# EAGLE design FeatherAB1805-Li (EAGLE 9.6.2)
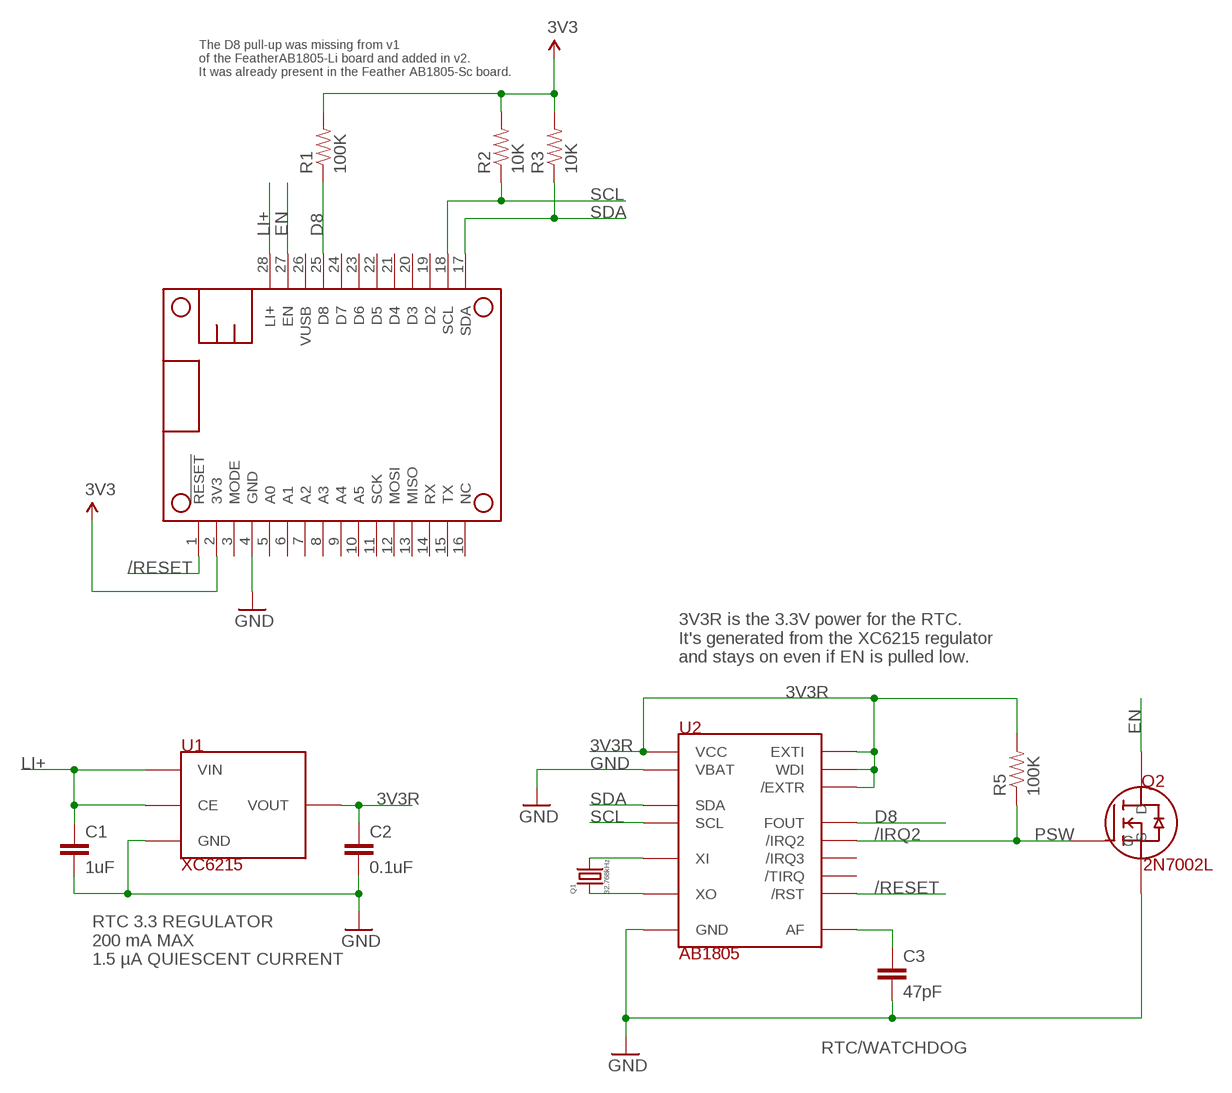
[diagram p0: schematic, sheet 1]

## Parts
C1  1uF  CAP-1UF-0603.DEV  [0603-CAP]
C2  0.1uF  CAP-0.1UF-0603  [0603-CAP]
C3  47pF  CAP-47PF-0603  [0603-CAP]
MS1  FEATHERWING_NODIM  [FEATHERWING_NODIM]
Q1  32.768kHz  ABS07-120-32.768KHZ  [ABS07-120-CRYSTAL]
Q2  2N7002L  [2N7002L]
R1  100K  RES-100K-0603  [0603-RES]
R2  10K  RES-10K-06030603  [0603-RES]
R3  10K  RES-10K-06030603  [0603-RES]
R5  100K  RES-100K-0603  [0603-RES]
U1  XC6215  [SOT-25-TOREX]
U2  AB1805  [16-VFQFN-ABRACON]

## Nets
3V3: MS1.2(3V3) R1.2 R2.2 R3.2
3V3R: C2.1 R5.2 U1.5(VOUT) U2.2(WDI) U2.3(/EXTR) U2.10(EXTI) U2.13(VCC)
/IRQ2: Q2.1(G) R5.1 U2.4(/IRQ2)
/RESET: MS1.1(!RESET) U2.1(/RST)
AF: C3.1 U2.14(AF)
D8: MS1.25(D8) R1.1 U2.11(FOUT)
EN: MS1.27(EN) Q2.3(D)
GND: C1.2 C2.2 C3.2 MS1.4(GND) Q2.2(S) U1.2(GND) U2.5(VBAT) U2.9(GND) U2.EP(GND)
LI+: C1.1 MS1.28(LI+) U1.1(VIN) U1.3(CE)
SCL: MS1.18(SCL) R2.1 U2.7(SCL)
SDA: MS1.17(SDA) R3.1 U2.6(SDA)
XI: Q1.2 U2.16(XI)
XO: Q1.1 U2.15(XO)
Unconnected: MS1.3(MODE) MS1.5(A0) MS1.6(A1) MS1.7(A2) MS1.8(A3) MS1.9(A4) MS1.10(A5) MS1.11(SCK) MS1.12(MOSI) MS1.13(MISO) MS1.14(RX) MS1.15(TX) MS1.16(NC) MS1.19(D2) MS1.20(D3) MS1.21(D4) MS1.22(D5) MS1.23(D6) MS1.24(D7) MS1.26(VUSB) U2.8(/IRQ3) U2.12(/TIRQ)

## Notes on the sheet
- The D8 pull-up was missing from v1
  of the FeatherAB1805-Li board and added in v2.
  It was already present in the Feather AB1805-Sc board.
- 3V3R is the 3.3V power for the RTC.
  It's generated from the XC6215 regulator
  and stays on even if EN is pulled low.
- PSW
- RTC 3.3 REGULATOR
  200 mA MAX
  1.5 µA QUIESCENT CURRENT
- RTC/WATCHDOG

## Library data of the parts
C1 = rickk2:CAP-1UF-0603.DEV: CAP CER 1UF 25V X7R 0603 $ 0.10 Samsung CL10B105KA8NNNC https://www.digikey.com/product-detail/en/samsung-electro-mechanics-america-inc/CL10B105KA8NNNC/1276-1184-1-ND/3889270 1µF ±10% 25V Ceramic Capacitor X7R 0603 (1608 Metric)
C2 = rickk2:CAP-0.1UF-0603: CAP CER 0.1UF 16V X7R 0603 https://www.digikey.com/product-detail/en/murata-electronics-north-america/GRM188R71C104KA01D/490-1532-1-ND/587771
C3 = rickk2:CAP-47PF-0603: CAP CER 47PF 100V C0G/NP0 0603 Murata Electronics GCM1885C2A470FA16D $0.22 47pF ±1% 100V Ceramic Capacitor C0G, NP0 0603 (1608 Metric) https://www.digikey.com/product-detail/en/murata-electronics/GCM1885C2A470FA16D/490-16408-1-ND/7363390 - Not ordered yet!
MS1 = Particle-Mesh:FEATHERWING
Q1 = rickk2:ABS07-120-32.768KHZ: CRYSTAL 32.7680KHZ 6PF SMD Abracon LLC ABS07-120-32.768KHZ-T $0.77 32.768kHz ±20ppm Crystal 6pF 55 kOhms 2-SMD, No Lead https://www.digikey.com/product-detail/en/abracon-llc/ABS07-120-32-768KHZ-T/535-11937-1-ND/3724046 - Not ordered yet
Q2 = rickk2:2N7002L: MOSFET N-CH 60V 0.115A SOT-23 $ 0.16 On Semicondutor 2N7002LT1G N-Channel 115mA (Tc) 225mW (Ta) Surface Mount SOT-23-3 (TO-236) https://www.digikey.com/product-detail/en/on-semiconductor/2N7002LT3G/2N7002LT3GOSCT-ND/2704932 1=G, high=D is connected to S (GND), the "on" state 2=S to GND (bottom of symbol) 3=D to load (top of symbol, pin on the side by itself) 2A version: Diodes Inc DMN6075S-7 MOSFET N-CH 60V 2A SOT23-3 $0.45 https://www.digikey.com/product-detail/en/diodes-incorporated/DMN6075S-7/DMN6075S-7DICT-ND/5149299 Old: https://www.digikey.com/product-detail/en/on-semiconductor/2N7002LT1G/2N7002LT1GOSCT-ND/917791
R1 R5 = rickk2:RES-100K-0603: 100 kOhms ±1% 0.1W, 1/10W Chip Resistor 0603 (1608 Metric) Automotive AEC-Q200 Thick Film https://www.digikey.com/product-detail/en/panasonic-electronic-components/ERJ-3EKF1003V/P100KHCT-ND/198110 Old: RES SMD 100K OHM 1% 1/4W 0603 $ 0.16 Panasonic ERJ-PA3F1003V ±1% 0.25W, 1/4W Chip Resistor 0603 (1608 Metric) Automotive AEC-Q200, Pulse Withstanding Thick Film https://www.digikey.com/product-detail/en/panasonic-electronic-components/ERJ-PA3F1003V/P100KBYCT-ND/5036116
R2 R3 = rickk2:RES-10K-0603: RES SMD 10K OHM 5% 1/4W 0603 $ 0.10 https://www.digikey.com/product-detail/en/panasonic-electronic-components/ERJ-PA3J103V/P10KBZCT-ND/5036237
U1 = rickk2:XC6215: IC REG LINEAR 3.3V 200MA SOT25 Torex Semiconductor Ltd XC6215B332MR-G $0.71 Linear Voltage Regulator IC 1 Output 200mA SOT-25 https://www.digikey.com/product-detail/en/torex-semiconductor-ltd/XC6215B332MR-G/893-1078-1-ND/2138269 - Not ordered yet - 6V max input - 3.3V output 200 mA - 1.5µA quiescent current - 1uF input cap, 0.1 uF output cap - CE high to enable
U2 = rickk2:AB1805: Abracon LLC AB1805-T3 $1.79 IC RTC CLK/CALENDAR I2C 16-QFN Real Time Clock (RTC) IC Clock/Calendar 256B I²C, 2-Wire Serial 16-VFQFN Exposed Pad https://www.digikey.com/product-detail/en/abracon-llc/AB1805-T3/535-11932-1-ND/3661512

## Board
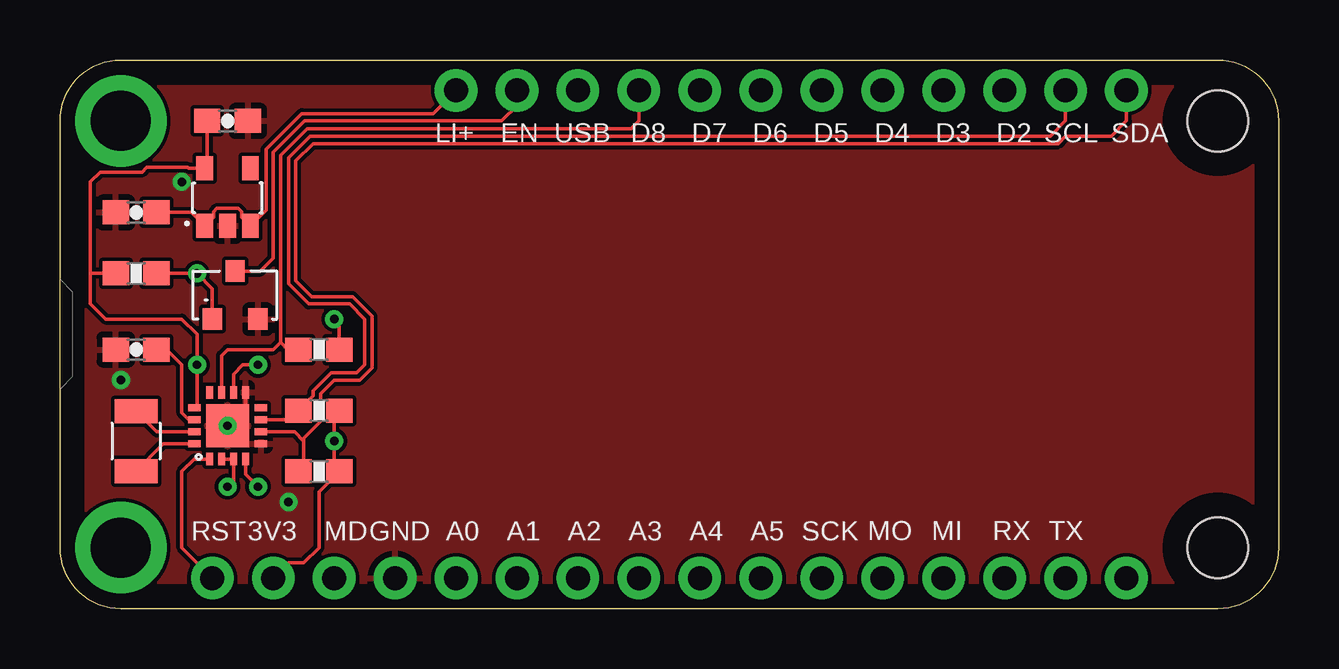
[diagram p1: board, top side]
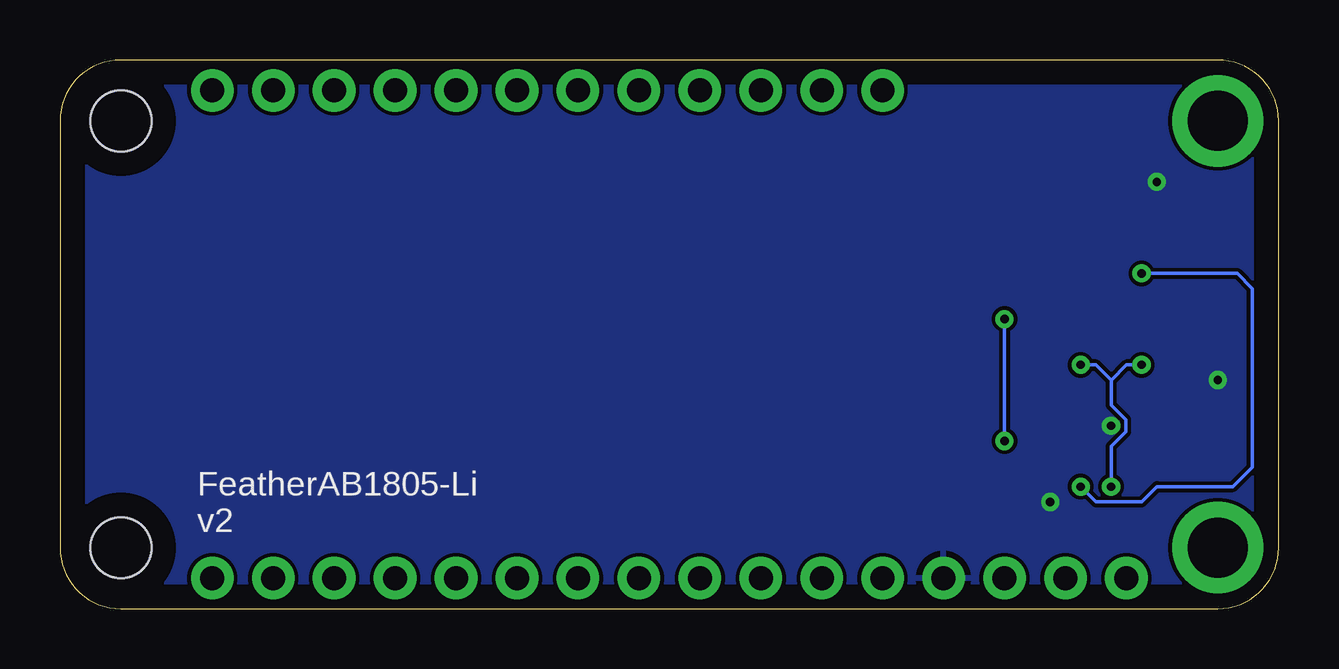
[diagram p2: board, bottom side, seen from below]

Size 50.8 x 22.86 mm. Coordinates in mm from the lower left corner, seen from the top.
Outline: 2.54,22.86 48.26,22.86 arc-90 50.8,20.32 50.8,2.54 arc-90 48.26,0 2.54,0 arc-90 0,2.54 0,20.32 arc-90 2.54,22.86
Copper layers (1*16): Top 0.035mm / dielectric 1.5mm / Bottom 0.035mm
Design rules "default": minimum track width 6mil, minimum drill 0.35mm, track to track 6mil, track to pad 6mil, pad to pad 6mil, via to via 6mil, smd to smd 6mil, copper to edge 40mil, drill to drill 6mil, minimum pad ring 10mil, minimum via ring 8mil, stop-mask expansion 4mil, vias tented up to drill 0mil, thermal gap 10mil

### Footprints (pad centres in the part's own frame; a part is rotated, then mirrored left to right if it is on the bottom)
0603-CAP = smd 1.1 x 1: 1 -0.85,0; 2 0.85,0
FEATHERWING_NODIM = drill 1 pad 1.778: 1 6.35,1.27; 2 8.89,1.27; 3 11.43,1.27; 4 13.97,1.27; 5 16.51,1.27; 6 19.05,1.27; 7 21.59,1.27; 8 24.13,1.27; 9 26.67,1.27; 10 29.21,1.27; 11 31.75,1.27; 12 34.29,1.27; 13 36.83,1.27; 14 39.37,1.27; 15 41.91,1.27; 16 44.45,1.27; 17 44.45,21.59; 18 41.91,21.59; 19 39.37,21.59; 20 36.83,21.59; 21 34.29,21.59; 22 31.75,21.59; 23 29.21,21.59; 24 26.67,21.59; 25 24.13,21.59; 26 21.59,21.59; 27 19.05,21.59; 28 16.51,21.59 | drill 2.5 pad 3.81: P$1 2.54,20.32; P$2 2.54,2.54 | hole 2.54: 48.26,20.32; 48.26,2.54
ABS07-120-CRYSTAL = smd 1 x 1.8: 1 -1.25,0; 2 1.25,0
2N7002L = smd 0.8 x 0.9: 1 0,0; 2 1.9,0; 3 0.95,2
0603-RES = smd 1.1 x 1: 1 -0.85,0; 2 0.85,0
SOT-25-TOREX = smd 0.7 x 1: 1 -0.95,-1.2; 2 0,-1.2; 3 0.95,-1.2; 4 0.95,1.2; 5 -0.95,1.2
16-VFQFN-ABRACON = smd 0.3 x 0.52: 1 -0.75,-1.39; 2 -0.25,-1.39; 3 0.25,-1.39; 4 0.75,-1.39; 9 0.75,1.39; 10 0.25,1.39; 11 -0.25,1.39; 12 -0.75,1.39 | smd 0.52 x 0.3: 5 1.39,-0.75; 6 1.39,-0.25; 7 1.39,0.25; 8 1.39,0.75; 13 -1.39,0.75; 14 -1.39,0.25; 15 -1.39,-0.25; 16 -1.39,-0.75 | smd 1.8 x 1.8: EP 0,0

### Placement (x,y rotation side)
C1  3.17,16.51 180 top
C2  6.99,20.32 0 top
C3  3.17,10.79 180 top
MS1  0,0 0 top
Q1  3.17,6.99 270 top
Q2  6.35,12.06 0 top
R1  10.79,10.79 0 top
R2  10.79,8.26 0 top
R3  10.79,5.71 0 top
R5  3.17,13.97 180 top
U1  6.99,17.14 0 top
U2  6.99,7.62 0 top

### Tracks (layer width: path | path; a pad name or v marks a point on that pad's centre or on a via)
3V3  (via drill 0.35)
  Top 0.152: MS1.2 9.53,1.91 10.16,1.91 10.79,2.54 10.79,4.87 R3.2 11.43,5.93 v11.43,6.99 11.43,8.04 R2.2 | R1.2 11.64,11.85 v11.43,12.06
  Bottom 0.152: v11.43,12.06 v11.43,6.99
3V3R  (via drill 0.35)
  Top 0.152: U2.2 U2.3 7.24,5.33 v6.99,5.08 | C2.1 6.13,18.45 U1.5 5.37,18.34 5.33,18.39 3.62,18.39 3.42,18.19 1.68,18.19 1.27,17.78 1.27,15.24 1.27,13.97 | 1.27,13.97 1.27,12.7 1.91,12.06 5.08,12.06 5.71,11.43 v5.71,10.16 5.71,8.49 U2.13 | R5.2 1.27,13.97 | v8.26,10.16 7.62,10.16 7.24,9.78 U2.10
  Bottom 0.152: v6.99,5.08 6.99,6.76 6.38,7.37 6.38,7.87 6.99,8.48 6.99,9.53 | v5.71,10.16 6.35,10.16 6.99,9.53 | 6.99,9.53 7.62,10.16 v8.26,10.16
/IRQ2  (via drill 0.35)
  Top 0.152: U2.4 7.74,5.6 v8.26,5.08 | R5.1 v5.71,13.97 6.35,13.34 Q2.1
  Bottom 0.152: v8.26,5.08 7.62,4.45 5.71,4.45 5.08,5.08 1.91,5.08 1.09,5.89 1.09,13.34 1.73,13.97 v5.71,13.97
/RESET
  Top 0.152: MS1.1 5.08,2.54 5.08,5.71 5.59,6.23 U2.1
AF
  Top 0.152: C3.1 4.45,10.79 5.08,10.16 5.08,8.15 5.36,7.87 U2.14
D8
  Top 0.152: MS1.25 24.13,20.32 23.8,19.99 10.3,19.99 9.2,18.88 9.2,11.1 | 9.2,11.1 8.89,10.79 6.99,10.79 6.74,10.54 U2.11 | R1.1 9.5,10.79 9.2,11.1
EN
  Top 0.152: MS1.27 19.05,20.95 18.41,20.32 10.2,20.32 8.89,19.01 8.89,14.61 8.35,14.06 Q2.3
GND  (via drill 0.35)
  Top 0.152: U2.9 7.74,8.37 U2.EP
  other vias: 6.99,7.62 2.54,9.53 5.08,17.78 9.53,4.45
  pour Top: 0,0 0,25.4 53.34,25.4 53.34,0
  pour Bottom: 0,0 0,27.94 50.8,27.94 50.8,0
LI+
  Top 0.152: MS1.28 15.54,20.62 10.07,20.62 8.59,19.14 8.59,16.59 U1.3 7.56,16.32 7.56,16.54 7.43,16.67 6.54,16.67 6.41,16.54 6.41,16.32 U1.1 5.47,16.51 C1.1
SCL
  Top 0.152: U2.7 9.56,7.87 R2.1 10.56,8.87 10.56,9.09 11.3,9.83 12.37,9.83 12.7,10.16 12.7,12.06 12.06,12.7 10.36,12.7 9.53,13.54 9.53,18.78 10.43,19.68 41.27,19.68 41.91,20.32 MS1.18
SDA
  Top 0.152: MS1.17 44.45,20.32 43.81,19.68 41.91,19.68 41.6,19.38 10.55,19.38 9.83,18.66 9.83,13.66 10.49,13.01 12.19,13.01 13.01,12.19 13.01,10.03 12.5,9.53 11.43,9.53 10.87,8.96 10.87,7.8 10.16,7.1 10.16,6.99 | U2.6 9.78,7.37 10.16,6.99 | 10.16,6.99 10.16,5.93 R3.1
XI
  Top 0.152: Q1.2 4.31,6.87 U2.16
XO
  Top 0.152: U2.15 4.04,7.37 Q1.1

### Text on the board
tPlace: LI+ | EN | USB | D8 | D7 | D6 | D5 | D4 | D3 | D2 | SCL | SDA | RST | 3V3 | MD | GND | A0 | A1 | A2 | A3 | A4 | A5 | SCK | MO | MI | RX | TX
bPlace: FeatherAB1805-Li / v2